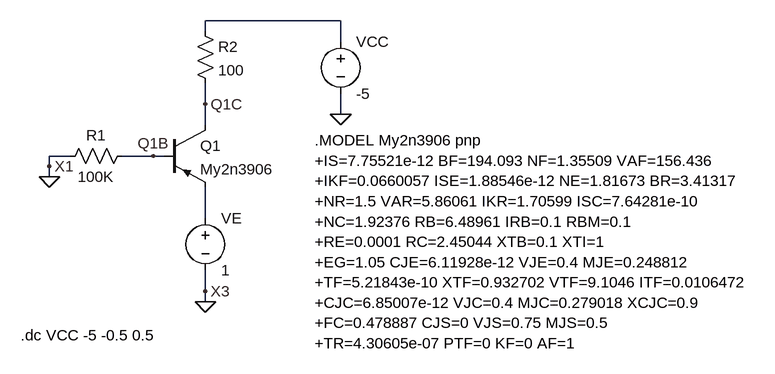
[diagram p0: schematic project1_p2.asc]
project1_p2.asc, the LTspice schematic file:
Version 4
SHEET 1 1056 680
WIRE 368 -96 160 -96
WIRE 160 -80 160 -96
WIRE 368 -64 368 -96
WIRE 160 32 160 0
WIRE 368 48 368 16
WIRE 160 64 160 32
WIRE -48 112 -80 112
WIRE 80 112 32 112
WIRE 96 112 80 112
WIRE -80 128 -80 112
WIRE -80 144 -80 128
WIRE 160 208 160 160
WIRE 160 320 160 288
WIRE 160 336 160 320
FLAG 160 336 0
FLAG -80 144 0
FLAG 368 48 0
FLAG 160 320 X3
FLAG -80 128 X1
FLAG 80 112 Q1B
FLAG 160 32 Q1C
SYMBOL pnp 96 64 R0
SYMATTR InstName Q1
SYMATTR Value My2n3906
SYMBOL voltage 160 192 R0
WINDOW 123 0 0 Left 0
WINDOW 39 0 0 Left 0
SYMATTR InstName VE
SYMATTR Value 1
SYMBOL res 48 96 R90
WINDOW 0 0 56 VBottom 2
WINDOW 3 32 56 VTop 2
SYMATTR InstName R1
SYMATTR Value 100K
SYMBOL res 144 -96 R0
SYMATTR InstName R2
SYMATTR Value 100
SYMBOL voltage 368 -80 R0
SYMATTR InstName VCC
SYMATTR Value -5
TEXT 328 88 Left 2 !.MODEL My2n3906 pnp\n+IS=7.75521e-12 BF=194.093 NF=1.35509 VAF=156.436\n+IKF=0.0660057 ISE=1.88546e-12 NE=1.81673 BR=3.41317\n+NR=1.5 VAR=5.86061 IKR=1.70599 ISC=7.64281e-10\n+NC=1.92376 RB=6.48961 IRB=0.1 RBM=0.1\n+RE=0.0001 RC=2.45044 XTB=0.1 XTI=1\n+EG=1.05 CJE=6.11928e-12 VJE=0.4 MJE=0.248812\n+TF=5.21843e-10 XTF=0.932702 VTF=9.1046 ITF=0.0106472\n+CJC=6.85007e-12 VJC=0.4 MJC=0.279018 XCJC=0.9\n+FC=0.478887 CJS=0 VJS=0.75 MJS=0.5\n+TR=4.30605e-07 PTF=0 KF=0 AF=1
TEXT -124 388 Left 2 !.dc VCC -5 -0.5 0.5

The netlist it stands for:
* project1_p2.asc
Q1 Q1C Q1B N002 0 My2n3906
VE N002 0 1
R1 Q1B 0 100K
R2 N001 Q1C 100
VCC N001 0 -5
.model NPN NPN
.model PNP PNP
.lib standard.bjt
.MODEL My2n3906 pnp
+IS=7.75521e-12 BF=194.093 NF=1.35509 VAF=156.436
+IKF=0.0660057 ISE=1.88546e-12 NE=1.81673 BR=3.41317
+NR=1.5 VAR=5.86061 IKR=1.70599 ISC=7.64281e-10
+NC=1.92376 RB=6.48961 IRB=0.1 RBM=0.1
+RE=0.0001 RC=2.45044 XTB=0.1 XTI=1
+EG=1.05 CJE=6.11928e-12 VJE=0.4 MJE=0.248812
+TF=5.21843e-10 XTF=0.932702 VTF=9.1046 ITF=0.0106472
+CJC=6.85007e-12 VJC=0.4 MJC=0.279018 XCJC=0.9
+FC=0.478887 CJS=0 VJS=0.75 MJS=0.5
+TR=4.30605e-07 PTF=0 KF=0 AF=1
.dc VCC -5 -0.5 0.5
.backanno
.end